# EAGLE design LAD_1_0 (EAGLE 8.3.2)
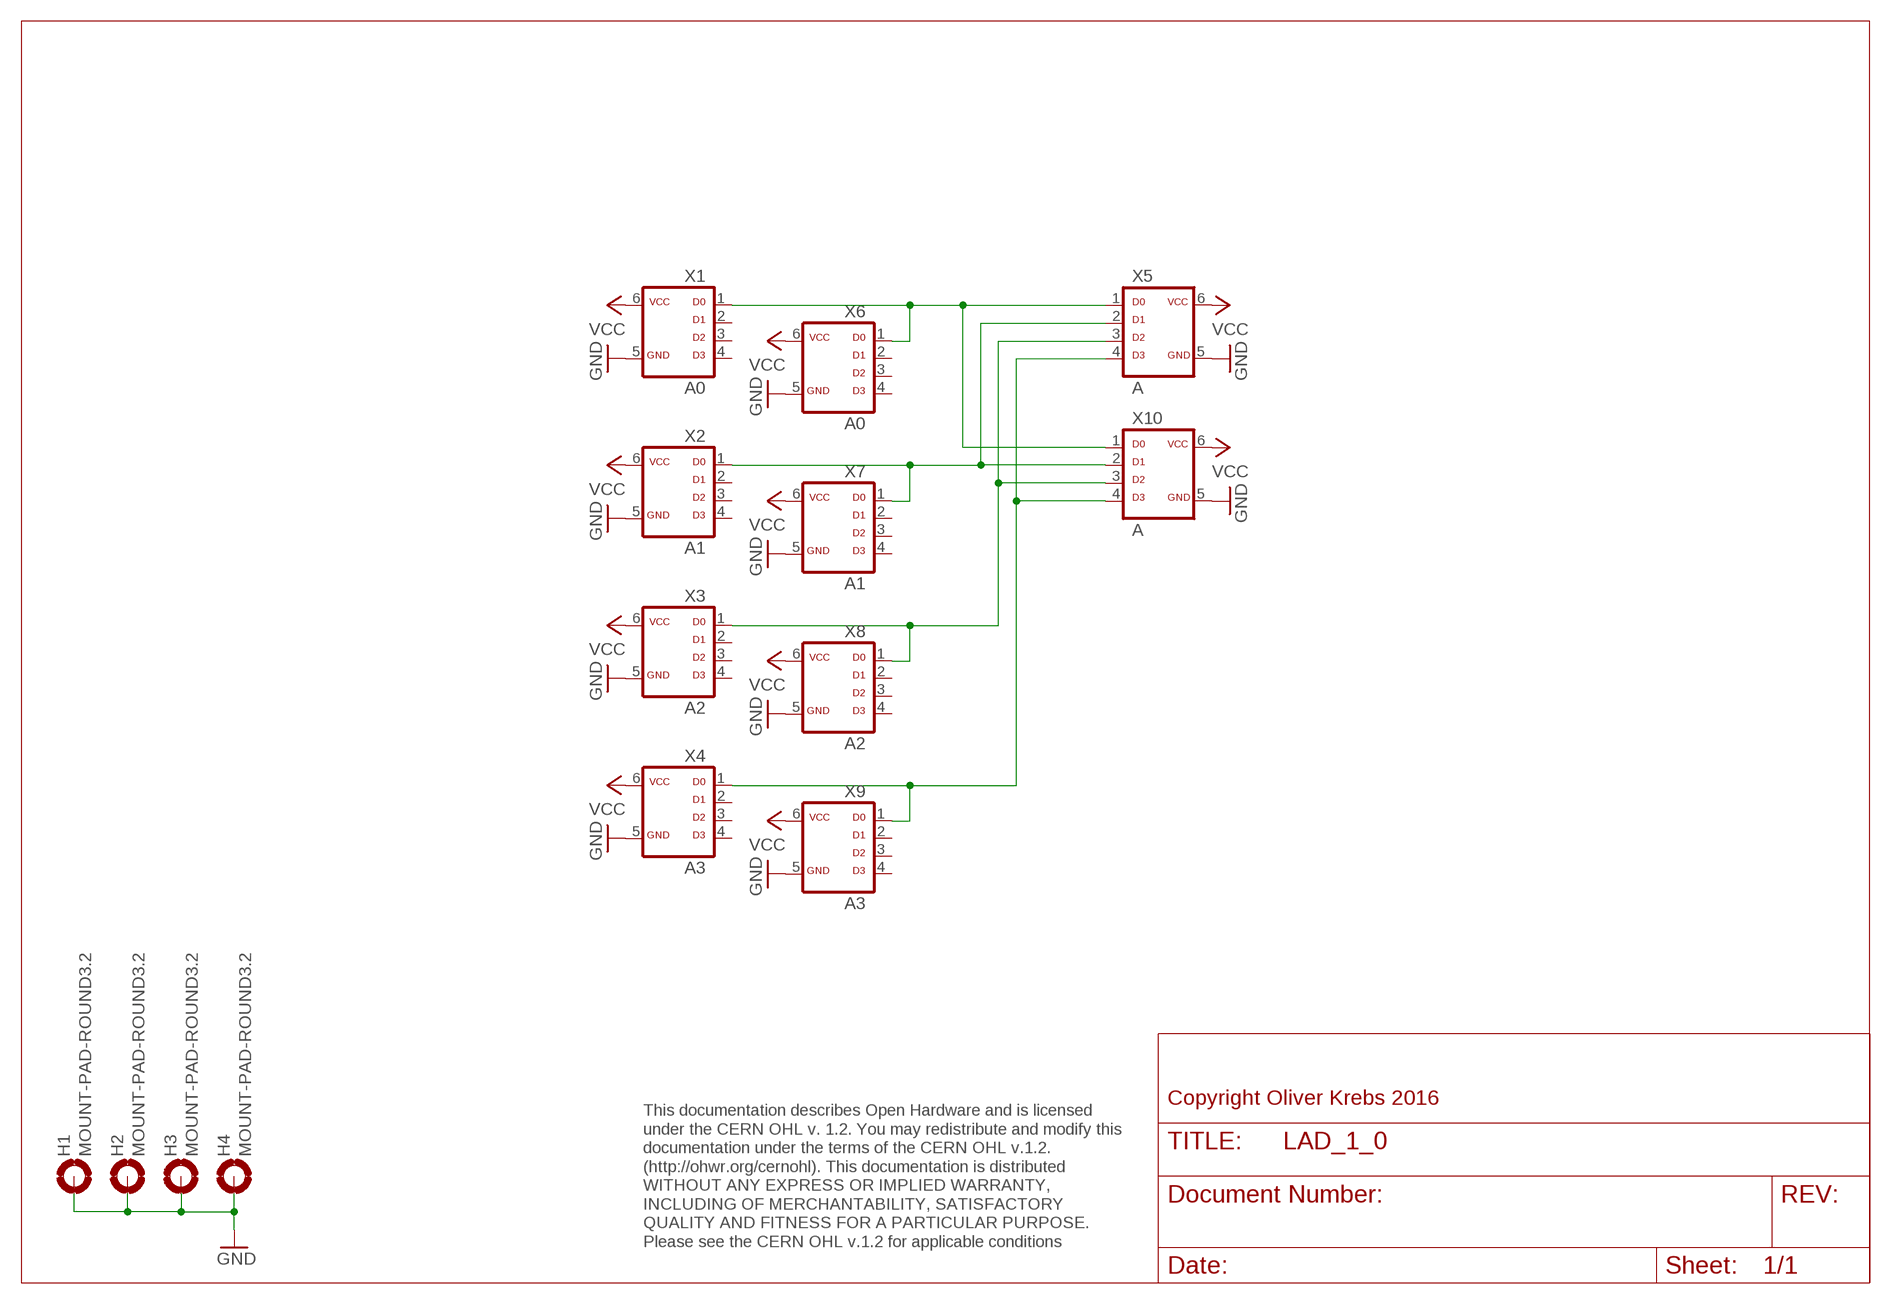
[diagram p0: schematic, sheet 1]

## Parts
H1  MOUNT-PAD-ROUND3.2  [3,2-PAD]
H2  MOUNT-PAD-ROUND3.2  [3,2-PAD]
H3  MOUNT-PAD-ROUND3.2  [3,2-PAD]
H4  MOUNT-PAD-ROUND3.2  [3,2-PAD]
X1  A0  ML6D  [ML-6]
X2  A1  ML6D  [ML-6]
X3  A2  ML6D  [ML-6]
X4  A3  ML6D  [ML-6]
X5  A  ML6D  [ML-6]
X6  A0  ML6D  [ML-6]
X7  A1  ML6D  [ML-6]
X8  A2  ML6D  [ML-6]
X9  A3  ML6D  [ML-6]
X10  A  ML6D  [ML-6]

## Nets
GND: H1.B3,2(MOUNT) H2.B3,2(MOUNT) H3.B3,2(MOUNT) H4.B3,2(MOUNT) X1.5 X2.5 X3.5 X4.5 X5.5 X6.5 X7.5 X8.5 X9.5 X10.5
N$4: X4.1 X5.4 X9.1 X10.4
N$6: X3.1 X5.3 X8.1 X10.3
N$7: X2.1 X5.2 X7.1 X10.2
N$8: X1.1 X5.1 X6.1 X10.1
VCC: X1.6 X2.6 X3.6 X4.6 X5.6 X6.6 X7.6 X8.6 X9.6 X10.6
Unconnected: X1.2 X1.3 X1.4 X2.2 X2.3 X2.4 X3.2 X3.3 X3.4 X4.2 X4.3 X4.4 X6.2 X6.3 X6.4 X7.2 X7.3 X7.4 X8.2 X8.3 X8.4 X9.2 X9.3 X9.4

## Notes on the sheet
- Copyright Oliver Krebs 2016
- This documentation describes Open Hardware and is licensed 
  under the CERN OHL v. 1.2. You may redistribute and modify this 
  documentation under the terms of the CERN OHL v.1.2. 
  (http://ohwr.org/cernohl). This documentation is distributed
  WITHOUT ANY EXPRESS OR IMPLIED WARRANTY, 
  INCLUDING OF MERCHANTABILITY, SATISFACTORY 
  QUALITY AND FITNESS FOR A PARTICULAR PURPOSE. 
  Please see the CERN OHL v.1.2 for applicable conditions

## Library data of the parts
H1-H4 = holes:MOUNT-PAD-ROUND: MOUNTING PAD, round
X1-X10 = 01-my-con:ML6D

## Board
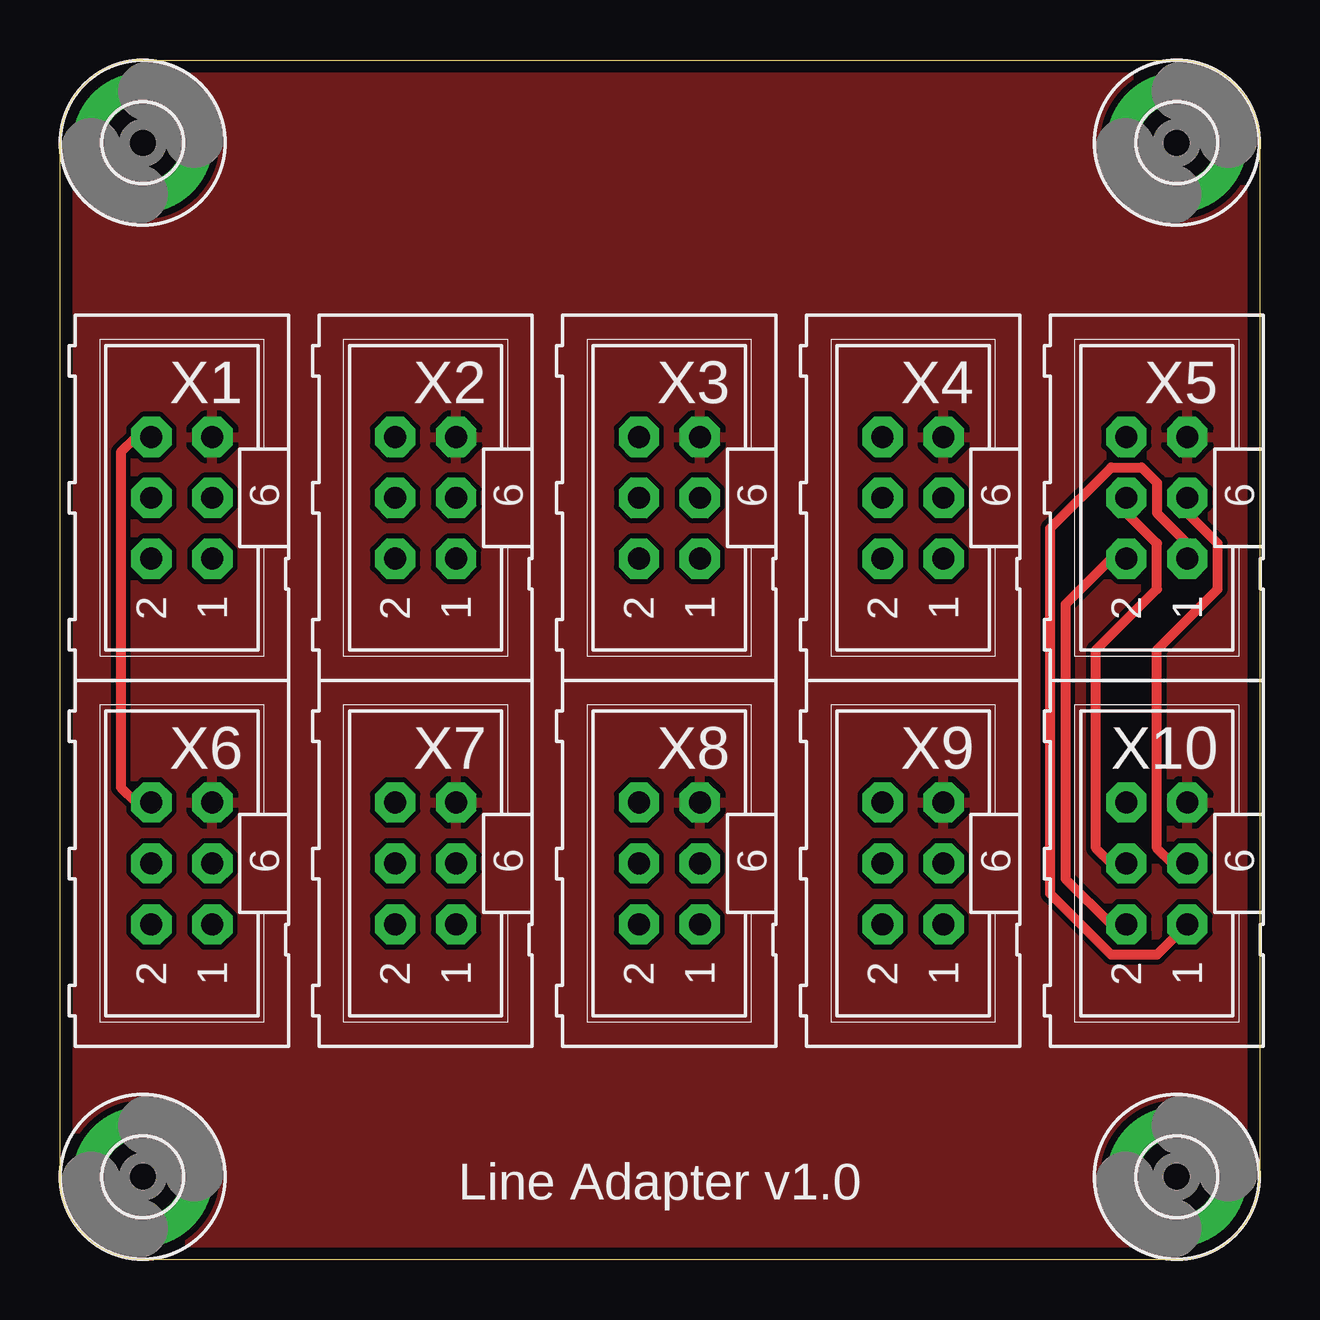
[diagram p1: board, top side]
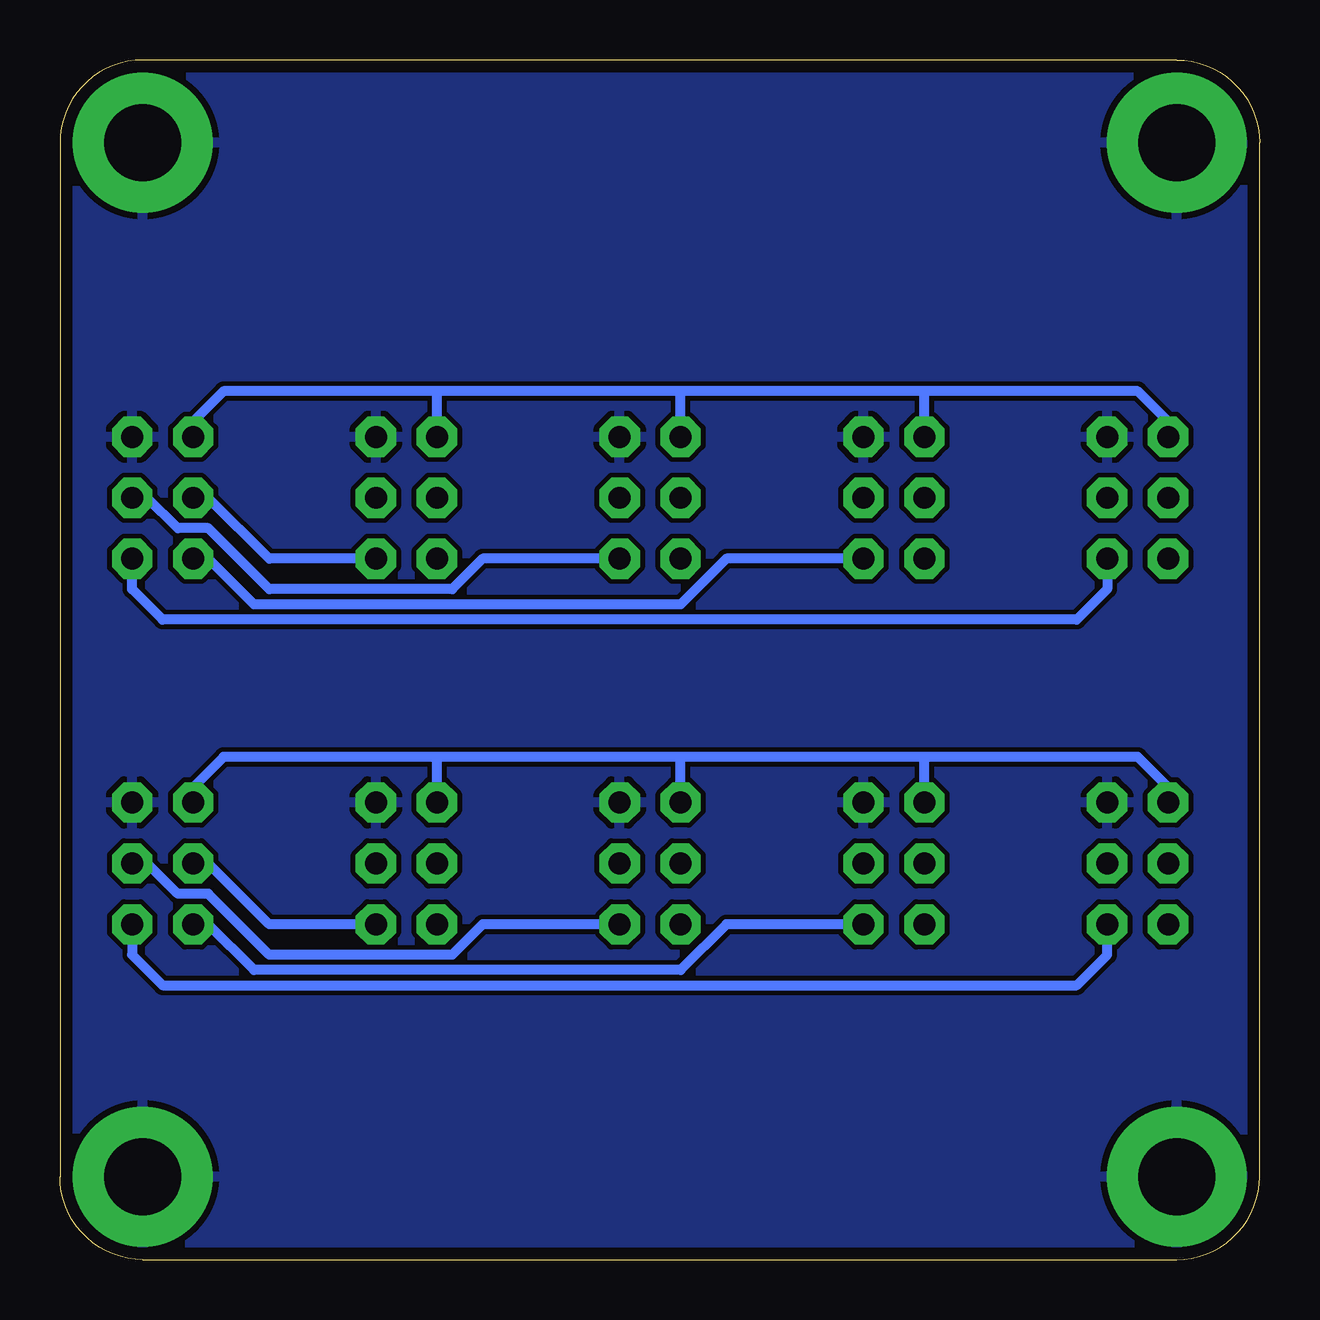
[diagram p2: board, bottom side, seen from below]

Size 50 x 50 mm. Coordinates in mm from the lower left corner, seen from the top.
Outline: 0,3.45 0,46.55 arc-90 3.45,50 46.55,50 arc-90 50,46.55 50,3.45 arc-90 46.55,0 3.45,0 arc-90 0,3.45
Copper layers (1*16): Top 0.035mm / dielectric 1.6mm / Bottom 0.035mm
Design rules "Elecrow_2-layer_PCB_eagle_rule *": minimum track width 6mil, minimum drill 12mil, track to track 8mil, track to pad 8mil, pad to pad 8mil, via to via 8mil, smd to smd 0mil, copper to edge 20mil, drill to drill 10mil, minimum pad ring 6mil, minimum via ring 6mil, stop-mask expansion 0mil, vias tented up to drill 100mil, thermal gap 10mil

### Footprints (pad centres in the part's own frame; a part is rotated, then mirrored left to right if it is on the bottom)
3,2-PAD = drill 3.2 pad 5.842: B3,2 0,0
ML-6 = drill 0.914 pad 1.676 octagon: 1 -2.54,-1.27; 2 -2.54,1.27; 3 0,-1.27; 4 0,1.27; 5 2.54,-1.27; 6 2.54,1.27

### Placement (x,y rotation side)
H1  3.45,3.45 0 top
H2  3.45,46.55 0 top
H3  46.55,46.55 0 top
H4  46.55,3.45 0 top
X1  5.08,31.75 90 top
X2  15.24,31.75 90 top
X3  25.4,31.75 90 top
X4  35.56,31.75 90 top
X5  45.72,31.75 90 top
X6  5.08,16.51 90 top
X7  15.24,16.51 90 top
X8  25.4,16.51 90 top
X9  35.56,16.51 90 top
X10  45.72,16.51 90 top

### Tracks (layer width: path | path; a pad name or v marks a point on that pad's centre or on a via)
GND
  pour Bottom: 0,0 50.8,0 50.8,50.8 0,50.8
  pour Top: 0,50.16 50.16,50.16 50.16,0 0,0
N$4
  Top 0.406: X5.4 44.45,31.11 45.72,29.84 45.72,27.94 43.18,25.4 43.18,17.14 43.81,16.51 X10.4
  Bottom 0.406: X4.1 41.27,29.21 43.81,31.75 X5.4 | X9.1 41.27,13.97 43.81,16.51 X10.4
N$6
  Top 0.406: X5.3 46.99,31.11 48.26,29.84 48.26,27.94 45.72,25.4 45.72,17.14 46.35,16.51 X10.3
  Bottom 0.406: X3.1 32.38,29.21 33.66,27.94 41.27,27.94 43.81,30.48 45.09,30.48 46.35,31.75 X5.3 | X8.1 32.38,13.97 33.66,12.7 41.27,12.7 43.81,15.24 45.09,15.24 46.35,16.51 X10.3
N$7
  Top 0.406: X10.2 43.81,13.97 41.91,15.88 41.91,27.3 43.81,29.21 X5.2
  Bottom 0.406: X2.1 22.23,29.21 24.13,27.3 41.91,27.3 43.81,29.21 X5.2 | X7.1 22.23,13.97 24.13,12.06 41.91,12.06 43.81,13.97 X10.2
N$8
  Top 0.406: X10.1 45.72,12.7 43.81,12.7 41.27,15.24 41.27,30.48 43.81,33.02 45.09,33.02 45.72,32.38 45.72,31.11 46.99,29.84 X5.1
  Bottom 0.406: X1.1 6.35,27.94 7.62,26.67 45.72,26.67 46.99,27.94 X5.1 | X10.1 46.99,12.7 45.72,11.43 7.62,11.43 6.35,12.7 X6.1
VCC
  Top 0.406: X6.6 3.17,19.05 2.54,19.68 2.54,33.66 3.17,34.29 X1.6
  Bottom 0.406: X6.6 3.81,19.68 5.08,20.95 13.97,20.95 | 13.97,20.95 24.13,20.95 | 24.13,20.95 34.29,20.95 | 34.29,20.95 43.18,20.95 44.45,19.68 X10.6 | X9.6 34.29,20.95 | X8.6 24.13,20.95 | X7.6 13.97,20.95 | X1.6 3.81,34.92 5.08,36.2 13.97,36.2 | 13.97,36.2 24.13,36.2 | 24.13,36.2 34.29,36.2 | 34.29,36.2 43.18,36.2 44.45,34.92 X5.6 | X4.6 34.29,36.2 | X3.6 24.13,36.2 | X2.6 13.97,36.2

### Text on the board
tNames: Line Adapter v1.0
200bmp: E:/Bilder/Elektronik/Modulion/Mexdulon/mexdulon_50x50_pcb.bmp